# EAGLE schematic speaker (EAGLE 8.2.2)
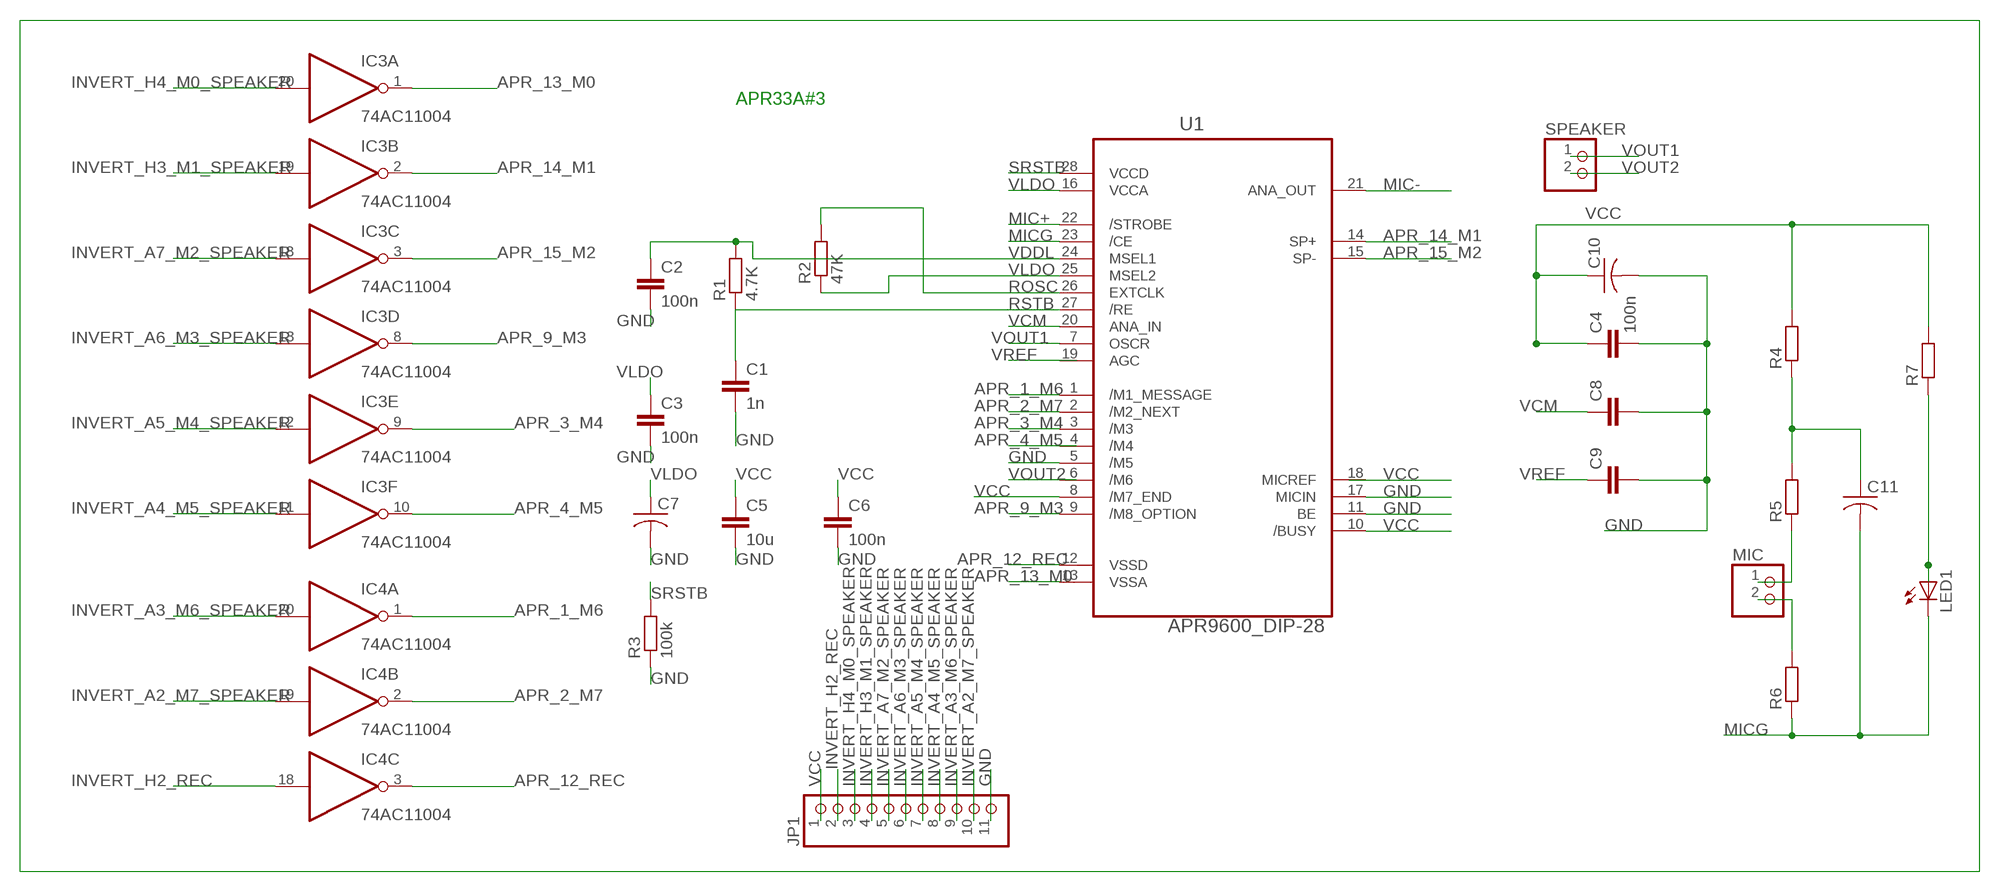
[diagram p0: schematic, sheet 1]

## Parts
C1  1n  C-EUC1206  [C1206]
C2  100n  C-EUC1206  [C1206]
C3  100n  C-EUC1206  [C1206]
C4  100n  C-EUC1206  [C1206]
C5  10u  C-EUC1206  [C1206]
C6  100n  C-EUC1206  [C1206]
C7  C-US025-050X050  [C025-050X050]
C8  C-EUC1206  [C1206]
C9  C-EUC1206  [C1206]
C10  C-US025-050X050  [C025-050X050]
C11  C-US025-050X050  [C025-050X050]
IC3  74AC11004  [DIL20]
IC4  74AC11004  [DIL20]
JP1  PINHD-1X11  [1X11]
LED1  LEDSMT1206  [1206]
MIC  PINHD-1X2  [1X02]
R1  4.7K  R-EU_M1206  [M1206]
R2  47K  R-EU_M1206  [M1206]
R3  100k  R-EU_M1206  [M1206]
R4  R-EU_R1206  [R1206]
R5  R-EU_R1206  [R1206]
R6  R-EU_R1206  [R1206]
R7  R-EU_R1206  [R1206]
SPEAKER  PINHD-1X2  [1X02]
U1  APR9600_DIP-28  [DIP254P1525X550-28P]

## Nets
APR_1_M6: IC4.1(A:O) U1.1(/M1_MESSAGE)
APR_2_M7: IC4.2(B:O) U1.2(/M2_NEXT)
APR_3_M4: IC3.9(E:O) U1.3(/M3)
APR_4_M5: IC3.10(F:O)
APR_9_M3: IC3.8(D:O) U1.9(/M8_OPTION)
APR_12_REC: IC4.3(C:O) U1.12(VSSD)
APR_13_M0: IC3.1(A:O) U1.13(VSSA)
APR_14_M1: IC3.2(B:O) U1.14(SP+)
APR_15_M2: IC3.3(C:O) U1.15(SP-)
GND: C1.2 C2.2 C3.2 C4.2 C5.2 C6.2 C7.2 C8.2 C9.2 C10.2 JP1.11 R3.1 U1.5(/M5) U1.11(BE) U1.17(MICIN)
INVERT_A2_M7_SPEAKER: IC4.19(B:I) JP1.10
INVERT_A3_M6_SPEAKER: IC4.20(A:I) JP1.9
INVERT_A4_M5_SPEAKER: IC3.11(F:I) JP1.8
INVERT_A5_M4_SPEAKER: IC3.12(E:I) JP1.7
INVERT_A6_M3_SPEAKER: IC3.13(D:I) JP1.6
INVERT_A7_M2_SPEAKER: IC3.18(C:I) JP1.5
INVERT_H2_REC: IC4.18(C:I) JP1.2
INVERT_H3_M1_SPEAKER: IC3.19(B:I) JP1.4
INVERT_H4_M0_SPEAKER: IC3.20(A:I) JP1.3
MIC+: U1.22(/STROBE)
MIC-: U1.21(ANA_OUT)
MICG: C11.2 LED1.C R6.1 U1.23(/CE)
N$6: C11.1 R4.1 R5.2
N$7: MIC.1 R5.1
N$8: MIC.2 R6.2
N$10: LED1.A R7.1
ROSC: R2.2 U1.26(EXTCLK)
RSTB: C1.1 R1.1 U1.27(/RE)
SRSTB: R3.2 U1.28(VCCD)
VCC: C4.1 C5.1 C6.1 C10.1 JP1.1 R4.2 R7.2 U1.8(/M7_END) U1.10(/BUSY)
VCM: C8.1 U1.20(ANA_IN)
VDDL: C2.1 R1.2 U1.24(MSEL1)
VLDO: C3.1 C7.1 R2.1 U1.16(VCCA) U1.25(MSEL2)
VOUT1: SPEAKER.1 U1.7(OSCR)
VOUT2: SPEAKER.2
VREF: C9.1
Unconnected: IC4.8(D:O) IC4.9(E:O) IC4.10(F:O) IC4.11(F:I) IC4.12(E:I) IC4.13(D:I) U1.4(/M4) U1.6(/M6) U1.18(MICREF) U1.19(AGC)

## Notes on the sheet
- APR33A#3

## Power pins joined to a net without a drawn wire
GND: IC3.4(P:GND) IC3.5(P:GND) IC3.6(P:GND) IC3.7(P:GND) IC4.4(P:GND) IC4.5(P:GND) IC4.6(P:GND) IC4.7(P:GND)
VCC: IC3.15(P:VCC) IC3.16(P:VCC) IC4.15(P:VCC) IC4.16(P:VCC)

## Library data of the parts
C1-C6 C8 C9 = rcl:C-EU: CAPACITOR, European symbol
C7 C10 C11 = rcl:C-US: CAPACITOR, American symbol
IC3 IC4 = 74ac-logic:74AC11004: Hex INVERTER
JP1 = pinhead:PINHD-1X11: PIN HEADER
LED1 = adafruit:LED: LED OSRAM: - CHIPLED LG R971, LG N971, LY N971, LG Q971, LY Q971, LO R971, LY R971 LH N974, LH R974 LS Q976, LO Q976, LY Q976 LO Q996 - Hyper CHIPLED LW Q18S LB Q993, LB Q99A, LB R99A - SideLED LS A670, LO A670, LY A670, LG A670, LP A670 LB A673, LV A673, LT A673, LW A673 LH A674 LY A675 LS A676, LA A676, LO A676, LY A676, LW A676 LS A679, LY A679, LG A679 - Hyper Micro SIDELED® LS Y876, LA Y876, LO Y876, LY Y876 LT Y87S - SmartLED LW L88C, LW L88S LB L89C, LB L89S, LG L890 LS L89K, LO L89K, LY L89K LS L896, LA L896, LO L896, LY L896 - TOPLED LS T670, LO T670, LY T670, LG T670, LP T670 LSG T670, LSP T670, LSY T670, LOP T670, LYG T670 LG T671, LOG T671, LSG T671 LB T673, LV T673, LT T673, LW T673 LH T674 LS T676, LA T676, LO T676, LY T676, LB T676, LH T676, LSB T676, LW T676 LB T67C, LV T67C, LT T67C, LS T67K, LO T67K, LY T67K, LW E67C LS E67B, LA E67B, LO E67B, LY E67B, LB E67C, LV E67C, LT E67C LW T67C LS T679, LY T679, LG T679 LS T770, LO T770, LY T770, LG T770, LP T770 LB T773, LV T773, LT T773, LW T773 LH T774 LS E675, LA E675, LY E675, LS T675 LS T776, LA T776, LO T776, LY T776, LB T776 LHGB T686 LT T68C, LB T68C - Hyper Mini TOPLED® LB M676 - Mini TOPLED Santana® LG M470 LS M47K, LO M47K, LY M47K Source: http://www.osram.convergy.de/
MIC SPEAKER = pinhead:PINHD-1X2: PIN HEADER
R1-R3 = rcl:R-EU_: RESISTOR, European symbol
R4-R7 = resistor:R-EU_: RESISTOR, European symbol
U1 = aplus:APR9600_DIP-28: SINGLE-CHIP VOICE RECORDING & PLAYBACK DEVICE FOR SINGLE 60 SECOND # Created by SCRIPT exported from Ultra Librarian Gold 5.3.88 Copyright © 1999-2010 # Tanvir Mohammed, Premier Farnell 2013-04-24 alf@cadsoft.de; MPN: APR9600_DIP-28; OC_FARNELL: unknown; OC_NEWARK: unknown; PACKAGE: DIP-28; SUPPLIER: APLUS INTEGRATED CIRCUITS INC